# EAGLE design irRemote (EAGLE 9.2.2)

## Sheet 1 of 2
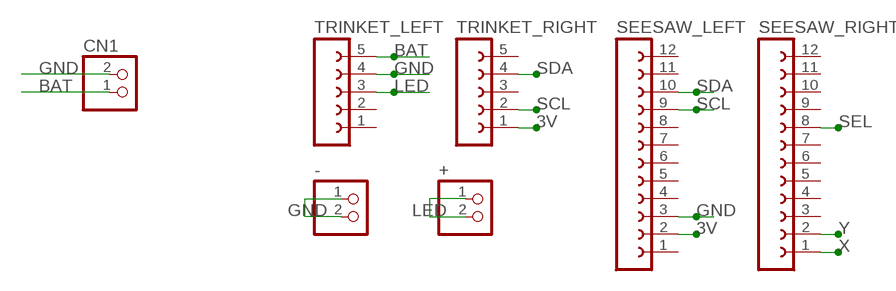
[diagram p0: schematic, sheet 1]

### Parts
+  PINHD-1X2  [1X02]
-  PINHD-1X2  [1X02]
CN1  JST_2PIN-SMT-RA  [JST-PH-2-SMT-RA]
SEESAW_LEFT  FE12-1  [FE12]
SEESAW_RIGHT  FE12-1  [FE12]
TRINKET_LEFT  FE05-1  [FE05-1]
TRINKET_RIGHT  FE05-1  [FE05-1]

### Nets
3V: SEESAW_LEFT.2 TRINKET_RIGHT.1 ; also sheet 2
BAT: CN1.1 TRINKET_LEFT.5
GND: -.1 -.2 CN1.2 SEESAW_LEFT.3 TRINKET_LEFT.4 ; also sheet 2
LED: +.1 +.2 TRINKET_LEFT.3
SCL: SEESAW_LEFT.9 TRINKET_RIGHT.2
SDA: SEESAW_LEFT.10 TRINKET_RIGHT.4
SEL: SEESAW_RIGHT.8 ; also sheet 2
X: SEESAW_RIGHT.1 ; also sheet 2
Y: SEESAW_RIGHT.2 ; also sheet 2
Unconnected: SEESAW_LEFT.1 SEESAW_LEFT.4 SEESAW_LEFT.5 SEESAW_LEFT.6 SEESAW_LEFT.7 SEESAW_LEFT.8 SEESAW_LEFT.11 SEESAW_LEFT.12 SEESAW_RIGHT.3 SEESAW_RIGHT.4 SEESAW_RIGHT.5 SEESAW_RIGHT.6 SEESAW_RIGHT.7 SEESAW_RIGHT.9 SEESAW_RIGHT.10 SEESAW_RIGHT.11 SEESAW_RIGHT.12 TRINKET_LEFT.1 TRINKET_LEFT.2 TRINKET_RIGHT.3 TRINKET_RIGHT.5

## Sheet 2 of 2
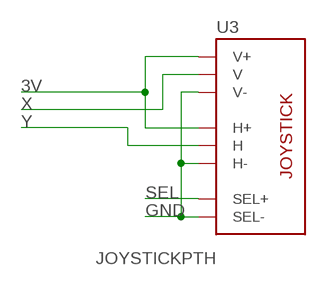
[diagram p1: schematic, sheet 2]

### Parts
U3  JOYSTICKPTH  [JOYSTICK]

### Nets
3V: U3.H1(H+) U3.V1(V+) ; also sheet 1
GND: U3.B2A(SEL-) U3.H3(H-) U3.V3(V-) ; also sheet 1
SEL: U3.B1A(SEL+) ; also sheet 1
X: U3.V2(V) ; also sheet 1
Y: U3.H2(H) ; also sheet 1

## Library data of the parts
+ - = pinhead:PINHD-1X2: PIN HEADER
CN1 = adafruit:JST_2PIN: JST 2-Pin Connectors of various flavors SMT-RA (S2B-PH-SM4) 4UConnector #17311 SMT (B2B-PH-SM4) THM-RA (S2B-PH) THM (B2B-PH)
SEESAW_LEFT SEESAW_RIGHT = con-lsta:FE12-1: FEMALE HEADER; OC_FARNELL: unknown; OC_NEWARK: unknown
TRINKET_LEFT TRINKET_RIGHT = con-lsta:FE05-1: FEMALE HEADER; OC_FARNELL: unknown; OC_NEWARK: unknown
U3 = adafruit:JOYSTICK: Thumb Joystick Joystick commonly found in PS2 controllers. Two pots and a select switch. Adapted from Sparkfun Library (but for more common 6mm switch sticks)

## Board
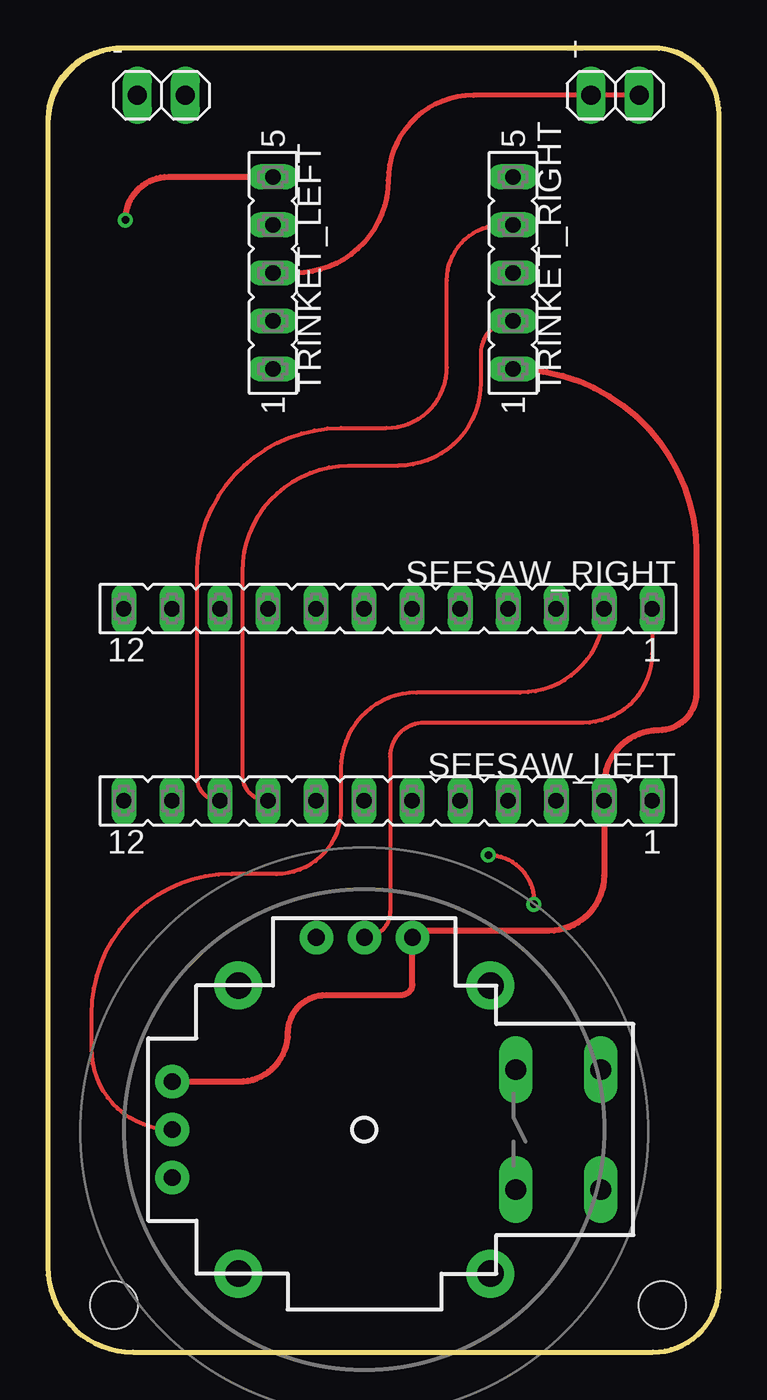
[diagram p2: board, top side]
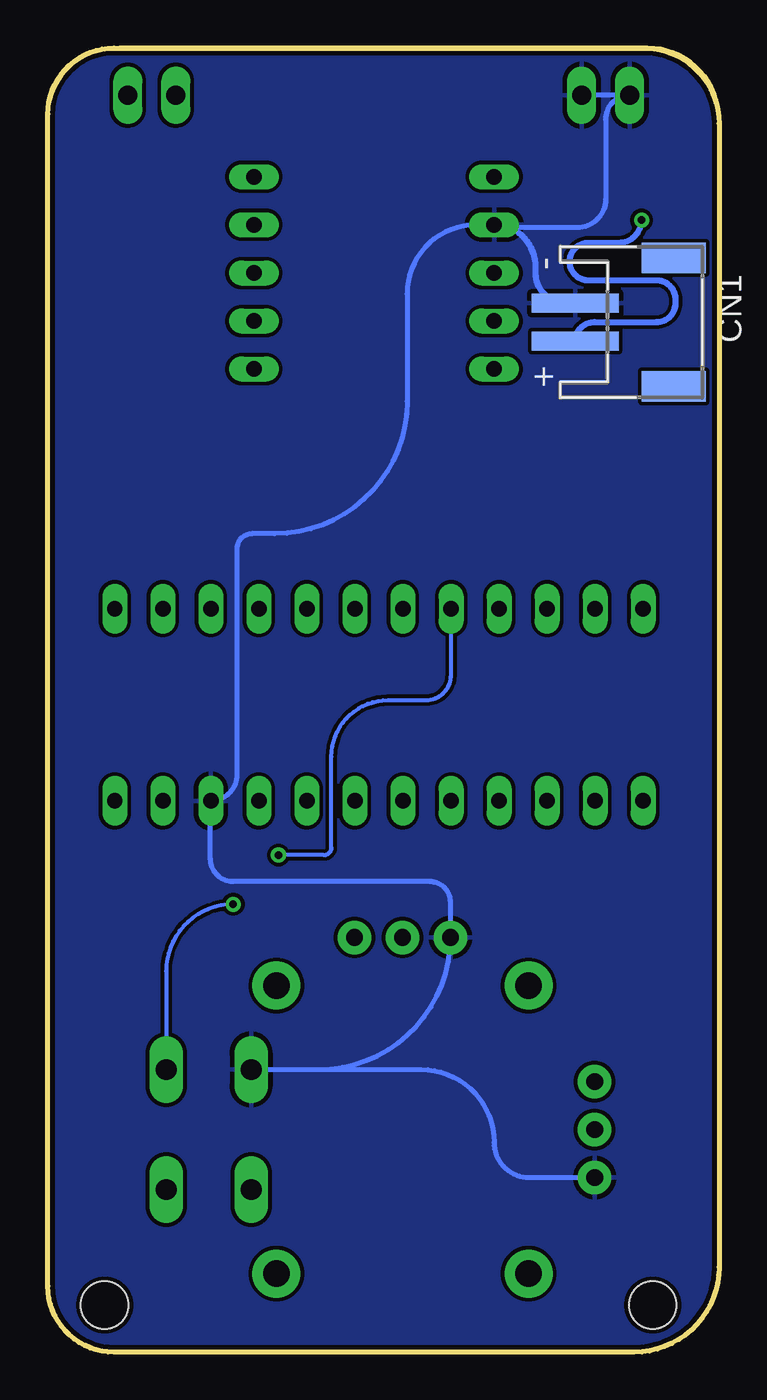
[diagram p3: board, bottom side, seen from below]

Size 35.56 x 69.04 mm. Coordinates in mm from the lower left corner, seen from the top.
Outline: 0,10.62 0,65.23 arc-90 3.81,69.04 31.75,69.04 arc-90 35.56,65.23 35.56,10.62
Outline: 0.03,4.5 arc90 4.53,0
Outline: 32.03,0 arc90 35.53,3.5
Outline: 0.03,4.5 arc90 4.53,0
Outline: 4.53,0 32.03,0
Outline: 32.03,0 arc90 35.53,3.5
Outline: 35.53,3.5 35.53,65.5 arc90 32.03,69 4.03,69 arc90 0.03,65 0.03,4.5
Copper layers (1*16): Top 0.035mm / dielectric 1.5mm / Bottom 0.035mm
Design rules "adafruit *": minimum track width 8mil, minimum drill 15.5mil, track to track 8mil, track to pad 8mil, pad to pad 8mil, via to via 8mil, smd to smd 8mil, copper to edge 10mil, drill to drill 8mil, minimum pad ring 10mil, minimum via ring 8mil, stop-mask expansion 2mil, vias tented up to drill 20mil, thermal gap 10mil
Holes 2.5 mm at 3.53,2.5 32.53,2.5

### Footprints (pad centres in the part's own frame; a part is rotated, then mirrored left to right if it is on the bottom)
1X02 = drill 1.016 long: 1 -1.27,0; 2 1.27,0
JST-PH-2-SMT-RA = smd 1 x 4.6: 1 1,-3.7; 2 -1,-3.7 | smd 1.6 x 3.4: NC1 -3.4,1.5; NC2 3.4,1.5
FE12 = drill 0.813 long: 1 -13.97,0; 2 -11.43,0; 3 -8.89,0; 4 -6.35,0; 5 -3.81,0; 6 -1.27,0; 7 1.27,0; 8 3.81,0; 9 6.35,0; 10 8.89,0; 11 11.43,0; 12 13.97,0
FE05-1 = drill 0.813 long: 1 -5.08,0; 2 -2.54,0; 3 0,0; 4 2.54,0; 5 5.08,0
JOYSTICK = drill 1.1 pad 1.778 long: B1A -3.175,12.501; B1B 3.175,12.501; B2A -3.175,8.001; B2B 3.175,8.001 | drill 0.889 pad 1.778: H1 -2.54,-10.16; H2 0,-10.16; H3 2.54,-10.16; V1 -10.16,2.54; V2 -10.16,0; V3 -10.16,-2.54 | drill 1.397 pad 2.54: MOUNT1 -7.62,6.668; MOUNT2 -7.62,-6.668; MOUNT3 7.62,-6.668; MOUNT4 7.62,6.668

### Placement (x,y rotation side)
+  30.03,66.5 0 top
-  6.03,66.5 0 top
CN1  3.93,54.5 270 bottom
SEESAW_LEFT  18.02,29.18 180 top
SEESAW_RIGHT  18.02,39.34 180 top
TRINKET_LEFT  11.93,57.1 90 top
TRINKET_RIGHT  24.63,57.1 90 top
U3  16.77,11.78 270 top

### Tracks (layer width: path | path; a pad name or v marks a point on that pad's centre or on a via)
3V
  Top 0.305: TRINKET_RIGHT.1 arc-90 34.33,42.32 34.33,34.9 arc-90 32.33,32.9 arc90 29.45,30.02 SEESAW_LEFT.2 29.45,25.22 arc-90 26.53,22.3 19.67,22.3 arc90 U3.V1 19.31,19.48 arc-90 18.73,18.9 14.73,18.9 arc90 12.73,16.9 arc-90 10.15,14.32 U3.H1
BAT  (via drill 0.39)
  Top 0.305: v4.13,59.9 arc-90 6.41,62.18 TRINKET_LEFT.5
  Bottom 0.305: CN1.1 arc90 6.63,54.5 3.33,54.5 arc-90 2.33,55.5 2.33,55.7 arc-90 3.33,56.7 6.93,56.7 arc90 7.93,57.7 arc90 6.93,58.7 5.33,58.7 arc-90 v4.13,59.9
GND
  Bottom 0.254: -.2 -.1 arc-90 6.03,65.23 6.03,61 arc90 7.53,59.5 11.79,59.5 arc90 TRINKET_LEFT.4 12.89,59.64 arc-90 16.53,56 16.53,50.3 arc90 23.53,43.3 24.73,43.3 arc-90 25.53,42.5 25.53,30.55 arc90 SEESAW_LEFT.3 arc-90 26.93,29.15 26.93,26.1 arc-90 25.73,24.9 15.33,24.9 arc90 14.23,23.8 U3.V3 arc90 21.22,14.96 | U3.B2A 21.22,14.96 | 21.22,14.96 15.79,14.96 arc90 11.93,11.1 arc-90 10.07,9.24 U3.H3
  Bottom 0.305: CN1.2 8.13,55.5 arc90 9.73,57.1 9.73,57.44 arc-90 TRINKET_LEFT.4
  pour Bottom: -2.54,69 39.37,69 39.37,-5.73 -2.54,-5.73
LED
  Top 0.254: +.2 +.1 22.53,66.5 arc90 18.03,62 arc-90 13.13,57.1 TRINKET_LEFT.3
SCL
  Top 0.203: SEESAW_LEFT.9 arc-90 10.33,30.51 10.33,41.3 arc-90 15.93,46.9 18.53,46.9 arc90 22.93,51.3 22.93,52.86 arc-90 TRINKET_RIGHT.2
SDA
  Top 0.203: SEESAW_LEFT.10 arc-90 7.93,30.37 7.93,41.3 arc-90 15.53,48.9 17.93,48.9 arc90 21.13,52.1 21.13,56.7 arc-90 24.07,59.64 TRINKET_RIGHT.4
SEL  (via drill 0.39)
  Top 0.203: v23.33,26.3 arc-90 25.73,23.9 v25.73,23.7
  Bottom 0.203: v25.73,23.7 arc-90 29.27,20.16 U3.B1A | v23.33,26.3 20.93,26.3 arc-90 20.53,26.7 20.53,31.5 arc90 17.53,34.5 15.53,34.5 arc-90 14.21,35.82 SEESAW_RIGHT.8
X
  Top 0.203: SEESAW_RIGHT.1 31.99,36.96 arc-90 28.33,33.3 19.93,33.3 arc90 18.13,31.5 18.13,23.3 arc-90 U3.V2
Y
  Top 0.203: SEESAW_RIGHT.2 arc-90 25.01,34.9 19.53,34.9 arc90 15.53,30.9 15.53,28.7 arc-90 12.13,25.3 9.73,25.3 arc90 2.33,17.9 2.33,16.06 arc90 U3.H2

### Text on the board
tDocu: D0/A4/SDA | D4/A2/RXD/MOSI | D1/A0/VOUT | D3/A3/TXD/SCK | D2/A1/SCL/MISO | D0/A4/SDA | D4/A2/RXD/MOSI | D1/A0/VOUT | D3/A3/TXD/SCK | D2/A1/SCL/MISO